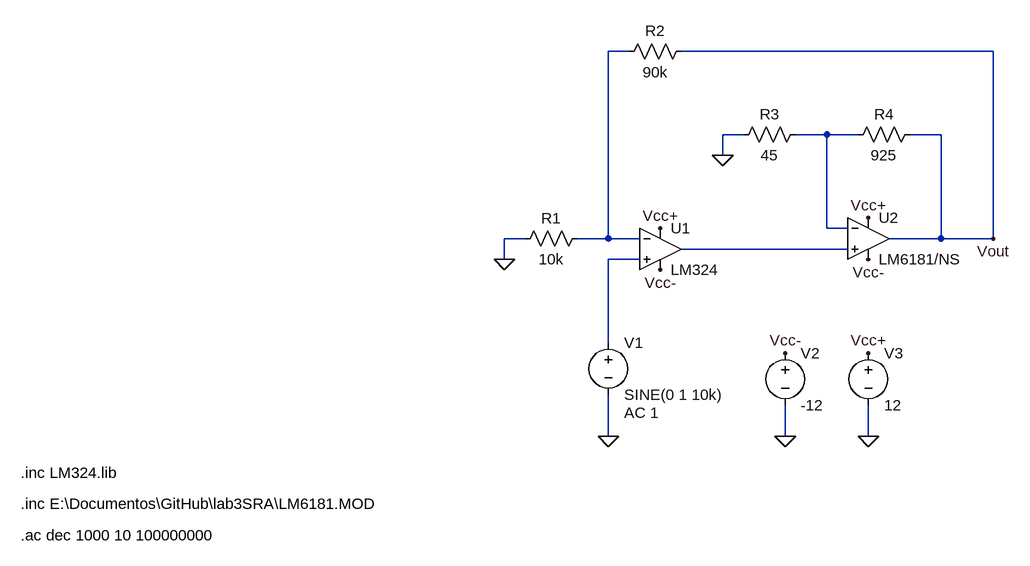
[diagram p0: schematic circuito2.4SANTI.asc]
circuito2.4SANTI.asc, the LTspice schematic file:
Version 4
SHEET 1 1508 680
WIRE -528 -80 -560 -80
WIRE 32 -80 -448 -80
WIRE -352 48 -384 48
WIRE -224 48 -272 48
WIRE -176 48 -224 48
WIRE -48 48 -96 48
WIRE -384 80 -384 48
WIRE -224 192 -224 48
WIRE -192 192 -224 192
WIRE -688 208 -720 208
WIRE -560 208 -560 -80
WIRE -560 208 -608 208
WIRE -512 208 -560 208
WIRE -48 208 -48 48
WIRE -48 208 -128 208
WIRE 32 208 32 -80
WIRE 32 208 -48 208
WIRE -192 224 -448 224
WIRE -720 240 -720 208
WIRE -512 240 -560 240
WIRE -560 368 -560 240
WIRE -560 512 -560 448
WIRE -288 512 -288 464
WIRE -160 512 -160 464
FLAG -384 80 0
FLAG -720 240 0
FLAG -560 512 0
FLAG -288 512 0
FLAG -160 512 0
FLAG -288 384 Vcc-
FLAG -480 256 Vcc-
FLAG -160 240 Vcc-
FLAG -160 384 Vcc+
FLAG -160 176 Vcc+
FLAG -480 192 Vcc+
FLAG 32 208 Vout
SYMBOL OpAmps\\opamp2 -480 160 R0
SYMATTR InstName U1
SYMATTR Value LM324
SYMBOL OpAmps\\opamp2 -160 144 R0
SYMATTR InstName U2
SYMATTR Value LM6181/NS
SYMBOL res -592 192 R90
WINDOW 0 0 56 VBottom 2
WINDOW 3 32 56 VTop 2
SYMATTR InstName R1
SYMATTR Value 10k
SYMBOL res -432 -96 R90
WINDOW 0 0 56 VBottom 2
WINDOW 3 32 56 VTop 2
SYMATTR InstName R2
SYMATTR Value 90k
SYMBOL res -256 32 R90
WINDOW 0 0 56 VBottom 2
WINDOW 3 32 56 VTop 2
SYMATTR InstName R3
SYMATTR Value 45
SYMBOL res -80 32 R90
WINDOW 0 0 56 VBottom 2
WINDOW 3 32 56 VTop 2
SYMATTR InstName R4
SYMATTR Value 925
SYMBOL voltage -560 352 R0
WINDOW 123 24 124 Left 2
WINDOW 39 0 0 Left 0
SYMATTR InstName V1
SYMATTR Value SINE(0 1 10k)
SYMATTR Value2 AC 1
SYMBOL voltage -288 368 R0
WINDOW 123 0 0 Left 0
WINDOW 39 0 0 Left 0
SYMATTR InstName V2
SYMATTR Value -12
SYMBOL voltage -160 368 R0
WINDOW 123 0 0 Left 0
WINDOW 39 0 0 Left 0
SYMATTR InstName V3
SYMATTR Value 12
TEXT -1464 664 Left 2 !.ac dec 1000 10 100000000
TEXT -1464 568 Left 2 !.inc LM324.lib
TEXT -1464 616 Left 2 !.inc E:\\Documentos\\GitHub\\lab3SRA\\LM6181.MOD

The netlist it stands for:
* circuito2.4SANTI.asc
XU1 N004 N001 Vcc+ Vcc- N003 LM324  ; pins In+ In- V+ V- OUT
XU2 N003 N002 Vcc+ Vcc- Vout LM6181/NS  ; pins In+ In- V+ V- OUT
R1 N001 0 10k
R2 Vout N001 90k
R3 N002 0 45
R4 Vout N002 925
V1 N004 0 SINE(0 1 10k) AC 1
V2 Vcc- 0 -12
V3 Vcc+ 0 12
.ac dec 1000 10 100000000
.inc LM324.lib
.inc E:\Documentos\GitHub\lab3SRA\LM6181.MOD
.backanno
.end